# Altium schematic sheet Sheet1.SchDoc: *Wireless
size A4
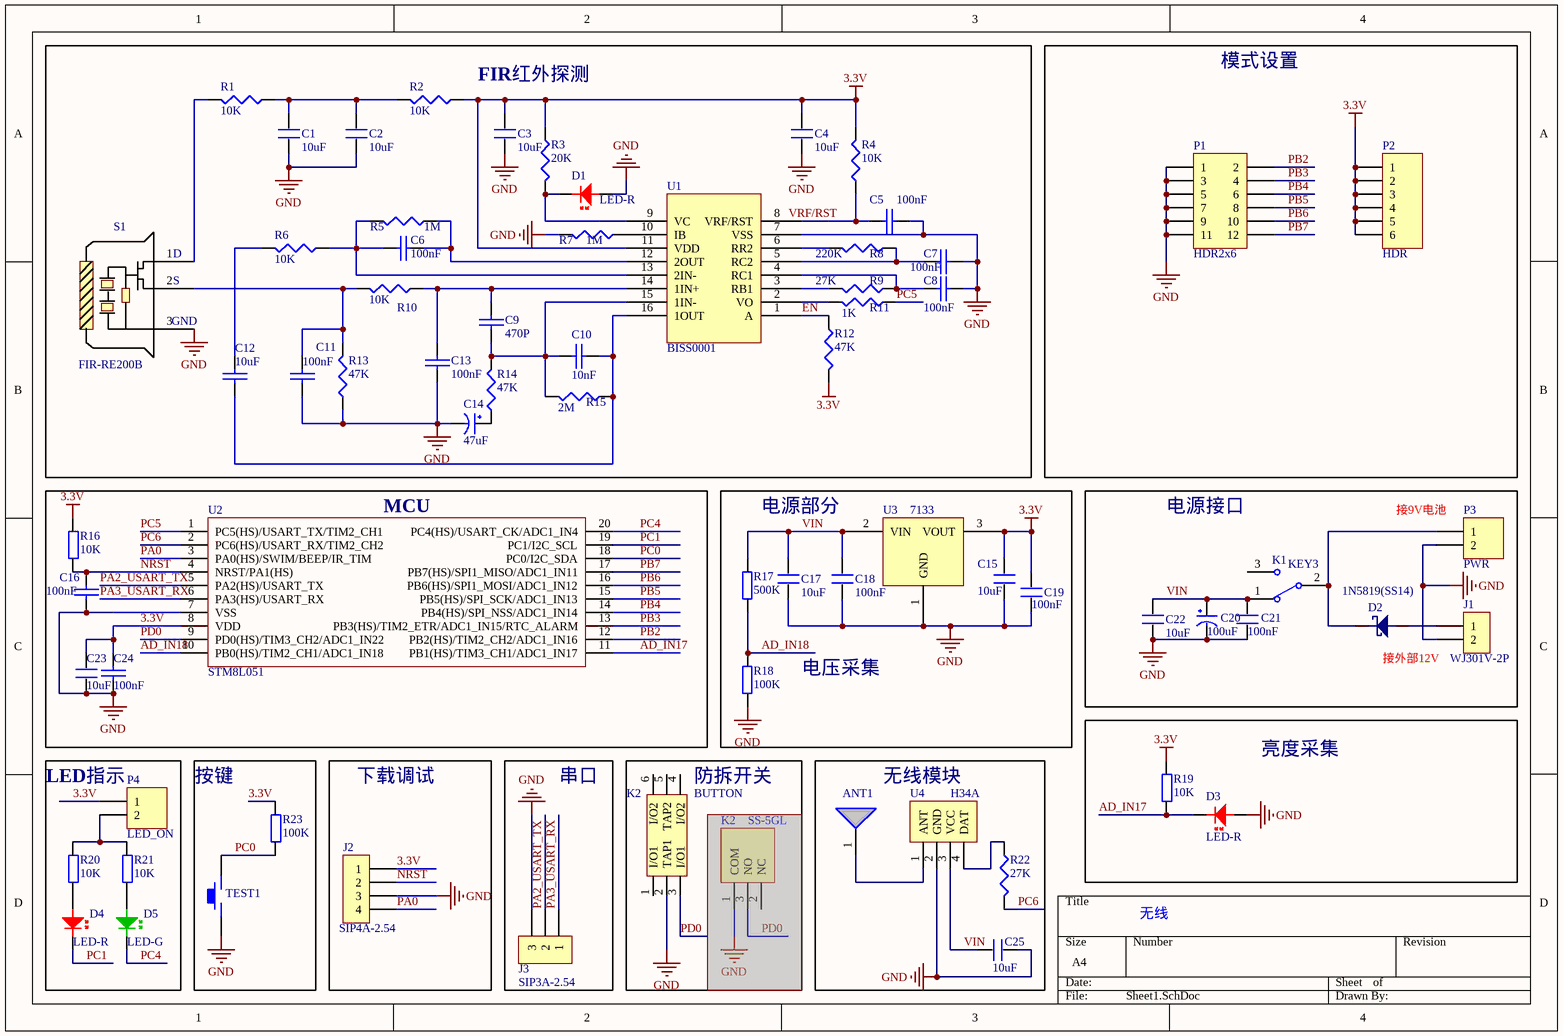
[diagram p0: Sheet1.SchDoc]

## Parts
(Parts that share a designator on the sheet are numbered #1, #2 ... from top to bottom, then left to right.)
ANT1  ANT  [ANT1]  (value not drawn)
C1  10uF  [0805-CAP]
C2  10uF  [0805-CAP]
C3  10uF  [0805-CAP]
C4  10uF  [0805-CAP]
C5  100nF  [0603-CAP]
C6  100nF  [0603-CAP]
C7  100nF  [0603-CAP]
C8  100nF  [0603-CAP]
C9  470P  [0603-CAP]
C10  10nF  [0603-CAP]
C11  100nF  [0603-CAP]
C12  10uF  [0805-CAP]
C13  100nF  [0603-CAP]
C14  47uF  [C6032]
C15  10uF  [0805-CAP]
C16  100nF  [0603-CAP]
C17  10uF  [0805-CAP]
C18  100nF  [0603-CAP]
C19  100nF  [0603-CAP]
C20  100uF  [CAP2.54]
C21  100nF  [0805-CAP]
C22  10uF  [0805-CAP]
C23  10uF  [0805-CAP]
C24  100nF  [0805-CAP]
C25  10uF  [0805-CAP]
D1  LED-R  [LED_5mm]
D2  1N5819(SS14)  [DO-214AC(SMA)]
D3  LED-R  [LED_5mm]
D4  LED-R  [DIO-LIG]
D5  LED-G  [DIO-LIG]
J1  WJ301V-2P  [WJ301V-2P]
J2  SIP4A-2.54  [HDR1X4]
J3  SIP3A-2.54  [HDR1x3]
K1  KEY3  [SK12D07VG3]
K2#1  SS-5GL  [SS-5GL]  (masked out: inside a compile mask, not in the netlist)
K2#2  BUTTON  [BTN7*7]
P1  HDR2x6  [HDR2x6-2.00]
P2  HDR  [HDR1x6-2.00]
P3  PWR  [2.54-2]
P4  LED_ON  [HDR1x2-2.00]
R1  10K  [0603-RES]
R2  10K  [0603-RES]
R3  20K  [0603-RES]
R4  10K  [0603-RES]
R5  1M  [0603-RES]
R6  10K  [0603-RES]
R7  1M  [0603-RES]
R8  220K  [0603-RES]
R9  27K  [0603-RES]
R10  10K  [0603-RES]
R11  1K  [0603-RES]
R12  47K  [0603-RES]
R13  47K  [0603-RES]
R14  47K  [0603-RES]
R15  2M  [0603-RES]
R16  10K  [0603-RES]
R17  500K  [0805-RES]
R18  100K  [0805-RES]
R19  10K  [0805-RES]
R20  10K  [0805-RES]
R21  10K  [0805-RES]
R22  27K  [0805-RES]
R23  100K  [0805-RES]
S1  FIR-RE200B  [TO-39]
TEST1  KEY_M  [KEY-SMD]  (value not drawn)
U1  BISS0001  [SOP16]
U2  STM8L051  [TSSOP20]
U3  7133  [SOT-89]
U4  H34A  [H34A]

## Blocks framed on the sheet
FIR红外探测: C1-C14 D1 R1-R15 S1 U1
模式设置: P1 P2
MCU: C16 C23 C24 R16 U2
电源接口: C20-C22 D2 J1 K1 P3
亮度采集: D3 R19
LED指示: D4 D5 P4 R20 R21
按键: R23 TEST1
下载调试: J2
串口: J3
防拆开关: K2#1 K2#2
无线模块: ANT1 C25 R22 U4

## Nets
3.3V: C3.2 C4.2 C15.2 C19.2 C23.2 C24.1 J2.1 P2.1 P2.2 P2.3 P2.4 P2.5 P2.6 P4.1 R2.1 R3.1 R4.2 R12.2 R16.2 R19.2 R23.2 U1.11(VDD) U2.8(VDD) U3.3(VOUT)
GND: C1.1 C2.1 C3.1 C4.1 C5.2 C7.2 C8.2 C11.2 C13.2 C14.2(GND) C15.1 C16.2 C17.1 C18.1 C19.1 C20.2(GND) C21.1 C22.1 C23.1 C24.2 C25.2 D1.1 D3.1 J1.2 J2.3 J3.3 K2#2.2(TAP1) P1.1 P1.3 P1.5 P1.7 P1.9 P1.11 P3.2 R7.2 R13.1 R18.2 S1.3 TEST1.1 U1.7(VSS) U2.7(VSS) U3.1(GND) U4.2(GND)
AD_IN17: D3.2 R19.1 U2.11(PB1(HS)/TIM3_CH1/ADC1_IN17)
AD_IN18: R17.2 R18.1 U2.10(PB0(HS)/TIM2_CH1/ADC1_IN18)
EN: R12.1 U1.1(A)
NRST: C16.1 J2.2 R16.1 U2.4(NRST/PA1(HS))
PA0: J2.4 U2.3(PA0(HS)/SWIM/BEEP/IR_TIM)
PA2_USART_TX: J3.2 U2.5(PA2(HS)/USART_TX)
PA3_USART_RX: J3.1 U2.6(PA3(HS)/USART_RX)
PB2: P1.2 U2.12(PB2(HS)/TIM2_CH2/ADC1_IN16)
PB3: P1.4 U2.13(PB3(HS)/TIM2_ETR/ADC1_IN15/RTC_ALARM)
PB4: P1.6 U2.14(PB4(HS)/SPI_NSS/ADC1_IN14)
PB5: P1.8 U2.15(PB5(HS)/SPI_SCK/ADC1_IN13)
PB6: P1.10 U2.16(PB6(HS)/SPI1_MOSI/ADC1_IN12)
PB7: P1.12 U2.17(PB7(HS)/SPI1_MISO/ADC1_IN11)
PC0: R23.1 TEST1.2 U2.18(PC0/I2C_SDA)
PC1: D4.2 U2.19(PC1/I2C_SCL)
PC4: D5.2 U2.20(PC4(HS)/USART_CK/ADC1_IN4)
PC5: R11.1 U2.1(PC5(HS)/USART_TX/TIM2_CH1)
PC6: R22.2 U2.2(PC6(HS)/USART_RX/TIM2_CH2)
PD0: K2#2.3(I/O1) U2.9(PD0(HS)/TIM3_CH2/ADC1_IN22)
VIN: C17.2 C18.2 C20.1(VCC) C21.2 C22.2 C25.1 K1.1 R17.1 U3.2(VIN) U4.3(VCC)
NetANT1_1: ANT1.1 U4.1(ANT)
NetC1_2: C1.2 C2.2 R1.1 R2.2
NetC5_1: C5.1 R4.1 U1.8(VRF/RST)
NetC6_1: C6.1 R5.2 R6.1 U1.13(2IN-)
NetC6_2: C6.2 R5.1 U1.12(2OUT)
NetC7_1: C7.1 R8.1 U1.5(RC2)
NetC8_1: C8.1 R9.1 U1.4(RC1)
NetC9_1: C9.1 C13.1 R10.1 U1.14(1IN+)
NetC9_2: C9.2 C10.1 R14.2 R15.2 U1.15(1IN-)
NetC10_2: C10.2 C12.2 R15.1 U1.16(1OUT)
NetC11_1: C11.1 R10.2 R13.2 S1.2
NetC12_1: C12.1 R6.2
NetC14_1: C14.1(VCC) R14.1
NetD1_2: D1.2 R3.2 U1.9(VC)
NetD2_1: D2.1 J1.1
NetD2_2: D2.2 K1.2 P3.1
NetD4_1: D4.1 R20.1
NetD5_1: D5.1 R21.1
NetP4_2: P4.2 R20.2 R21.2
NetR1_2: R1.2 S1.1
NetR7_1: R7.1 U1.10(IB)
NetR8_2: R8.2 U1.6(RR2)
NetR9_2: R9.2 U1.3(RB1)
NetR11_2: R11.2 U1.2(VO)
NetR22_1: R22.1 U4.4(DAT)

Not connected (* = marked no-connect by the designer): K1 3; K2#2 1(I/O1) 4(I/O2) 5(TAP2) 6(I/O2)

## Notes on the sheet
- 电源部分
- (near P3) 接9V电池
- 电压采集
- (near D2) 接外部12V
- 无线
- Labels drawn without touching a wire or pin: VRF/RST
- (in symbol FIR-RE200B) D; S; GND

## Library data of the parts
C1-C4 C15 C17-C19 C21-C23 C25 = C
C5-C14 C16 C20 C24 = CAP
D1 D3 D4 = LED-RED: 红色LED
D2 = 1N5819(SS14): 肖特基二极管
D5 = LED-GRE: 绿色LED
J1 = WJ301V-2P: 接线端子
J2 = SIP4A-2.50(带槽)
J3 = SIP3A-2.50（带槽）
K1 = KEY-3: 开关
K2#1 = SS-5GL: 轻触开关
P1 = HDR2x6: 排针
P2 = HDR1x6: Header, 6-Pin; LatestRevisionDate: 17-Jul-2002; LatestRevisionNote: Re-released for DXP Platform.; Publisher: Altium Limited
P3 = Header 2: Header, 2-Pin; LatestRevisionDate: 17-Jul-2002; LatestRevisionNote: Re-released for DXP Platform.; Publisher: Altium Limited
P4 = HDR1x2: Header, 2-Pin; LatestRevisionDate: 17-Jul-2002; LatestRevisionNote: Re-released for DXP Platform.; Publisher: Altium Limited
R1-R15 R22 = RES1
R16-R21 R23 = Res
U2 = STM8L051: 单片机
U4 = H34A: 无线发射